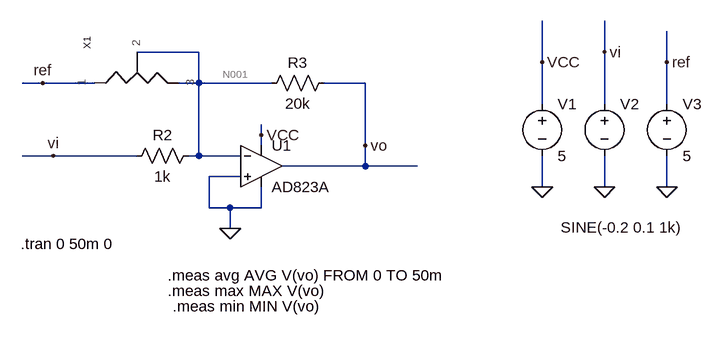
[diagram p0: schematic 2_18.asc]
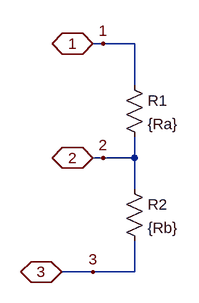
[diagram p1: sub-circuit dian_wei_qi.asc]
2_18.asc, the LTspice schematic file:
Version 4
SHEET 1 968 680
WIRE 112 -16 16 -16
WIRE 736 -16 736 -64
WIRE 640 0 640 -64
WIRE 832 0 832 -48
WIRE -128 32 -160 32
WIRE -48 32 -128 32
WIRE 112 32 112 -16
WIRE 112 32 80 32
WIRE 224 32 112 32
WIRE 368 32 304 32
WIRE 640 64 640 0
WIRE 736 64 736 -16
WIRE 832 64 832 0
WIRE 208 112 208 96
WIRE 208 128 208 112
WIRE 368 128 368 32
WIRE -112 144 -160 144
WIRE 16 144 -112 144
WIRE 112 144 112 32
WIRE 112 144 96 144
WIRE 176 144 112 144
WIRE 368 160 368 128
WIRE 368 160 240 160
WIRE 448 160 368 160
WIRE 176 176 128 176
WIRE 640 192 640 144
WIRE 736 192 736 144
WIRE 832 192 832 144
WIRE 128 224 128 176
WIRE 160 224 128 224
WIRE 208 224 208 192
WIRE 208 224 160 224
WIRE 160 256 160 224
FLAG 160 256 0
FLAG 640 192 0
FLAG 736 192 0
FLAG 208 112 VCC
FLAG 640 0 VCC
FLAG -112 144 vi
FLAG 736 -16 vi
FLAG -128 32 ref
FLAG 832 192 0
FLAG 832 0 ref
FLAG 368 128 vo
SYMBOL res 112 128 R90
WINDOW 0 0 56 VBottom 2
WINDOW 3 32 56 VTop 2
SYMATTR InstName R2
SYMATTR Value 1k
SYMBOL res 320 16 R90
WINDOW 0 0 56 VBottom 2
WINDOW 3 32 56 VTop 2
SYMATTR InstName R3
SYMATTR Value 20k
SYMBOL voltage 640 48 R0
WINDOW 123 0 0 Left 0
WINDOW 39 0 0 Left 0
SYMATTR InstName V1
SYMATTR Value 5
SYMBOL voltage 736 48 R0
WINDOW 3 -67 206 Left 2
WINDOW 123 0 0 Left 0
WINDOW 39 0 0 Left 0
SYMATTR InstName V2
SYMATTR Value SINE(-0.2 0.1 1k)
SYMBOL voltage 832 48 R0
WINDOW 123 0 0 Left 0
WINDOW 39 0 0 Left 0
SYMATTR InstName V3
SYMATTR Value 5
SYMBOL dian_wei_qi 16 48 R270
SYMATTR InstName X1
SYMATTR SpiceLine Ra=100k,Rb=10k
SYMBOL OpAmps\\AD823A 208 96 R0
SYMATTR InstName U1
TEXT -162 280 Left 2 !.tran 0 50m 0
TEXT 64 328 Left 2 !.meas avg AVG V(vo) FROM 0 TO 50m
TEXT 64 352 Left 2 !.meas max MAX V(vo)
TEXT 72 376 Left 2 !.meas min MIN V(vo)

dian_wei_qi.asc, the sub-circuit schematic file:
Version 4
SHEET 1 880 680
WIRE 144 -32 128 -32
WIRE 192 -32 144 -32
WIRE 192 32 192 -32
WIRE 144 144 128 144
WIRE 192 144 192 112
WIRE 192 144 144 144
WIRE 192 192 192 144
WIRE 128 320 80 320
WIRE 192 320 192 272
WIRE 192 320 128 320
FLAG 144 -32 1
FLAG 144 144 2
FLAG 128 320 3
FLAG 128 -32 1
IOPIN 128 -32 BiDir
FLAG 128 144 2
IOPIN 128 144 BiDir
FLAG 80 320 3
IOPIN 80 320 BiDir
SYMBOL res 176 16 R0
SYMATTR InstName R1
SYMATTR Value {Ra}
SYMBOL res 176 176 R0
SYMATTR InstName R2
SYMATTR Value {Rb}

The netlist it stands for:
* 2_18.asc
R2 N001 vi 1k
R3 vo N001 20k
V1 VCC 0 5
V2 vi 0 SINE(-0.2 0.1 1k)
V3 ref 0 5
XX1 ref N001 N001 dian_wei_qi params: Ra=100k,Rb=10k
XU1 0 N001 VCC 0 vo AD823A  ; pins In+ In- V+ V- OUT

* block symbol definitions
.subckt dian_wei_qi 1 2 3
R1 1 2 {Ra}
R2 2 3 {Rb}
.ends dian_wei_qi

.tran 0 50m 0
.meas avg AVG V(vo) FROM 0 TO 50m
.meas max MAX V(vo)
.meas min MIN V(vo)
.backanno
.end

* Results of the author's LTspice run, read from the files saved beside the schematic
* Operating Point, zero values left out:
*   V(n001) = -2.209 µV
*   V(vi) = -200 mV
*   V(vo) = 3 V
*   V(vcc) = 5 V
*   V(ref) = 5 V
*   I(R3) = 150 µA
*   I(R2) = 200 µA
*   I(V3) = -50 µA
*   I(V2) = 200 µA
*   I(V1) = -2.777 mA
*   Ix(x1:1) = 50 µA
*   Ix(x1:2) = -50 µA
*   Ix(u1:1) = -5.25 pA
*   Ix(u1:2) = -5.25 pA
*   Ix(u1:3) = 2.777 mA
*   Ix(u1:4) = -2.627 mA
*   Ix(u1:5) = -150 µA
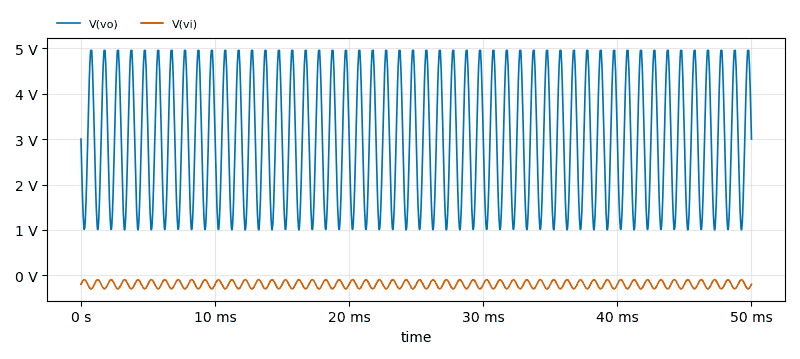
[diagram p2: Transient Analysis of 2_18.asc, plotted from the saved traces]
* Transient Analysis, 1 run:
*   V(vo): min 1 V, max 4.958 V, average 3.001 V, rms 3.315 V, last 3.003 V
*   V(vi): min -300 mV, max -100 mV, average -200 mV, rms 212.3 mV, last -200 mV
* From the log:
*   avg: AVG(v(vo))=3.00258 FROM 0 TO 0.05
*   max: MAX(v(vo))=4.95812 FROM 0 TO 0.05
*   min: MIN(v(vo))=0.999974 FROM 0 TO 0.05